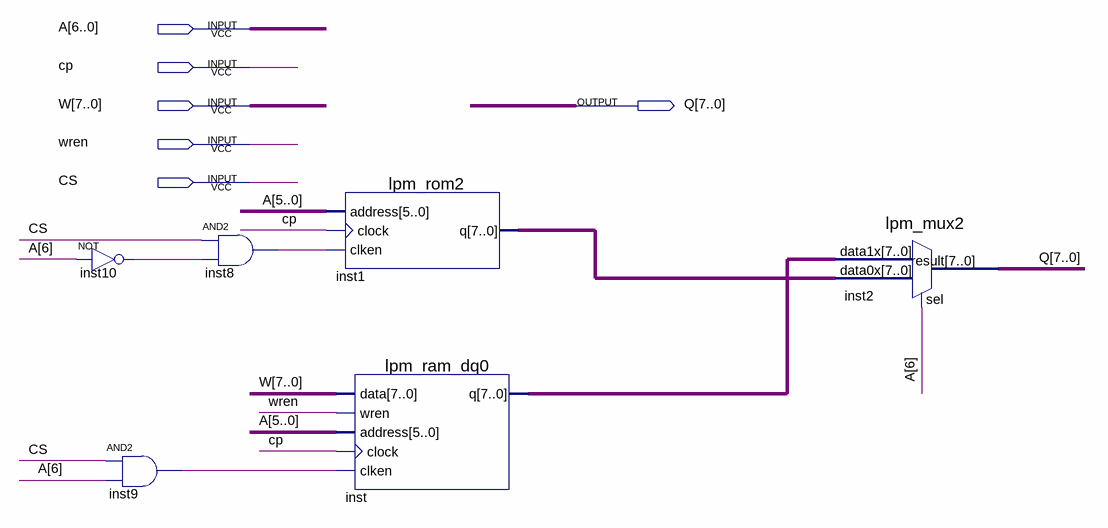
[diagram p0: schematic sheet]
// Quartus schematic MEM.bdf as structural Verilog: 6 symbols, 6 pins
module MEM (
  input  [6:0] A,
  input  cp,
  input  [7:0] W,
  input  wren,
  input  CS,
  output [7:0] Q
);

  wire inst8_out, inst9_out, inst10_out;
  wire [7:0] inst1_q, inst_q;

  not inst10 (inst10_out, A[6]);
  and inst9 (inst9_out, CS, A[6]);
  and inst8 (inst8_out, CS, inst10_out);
  lpm_rom2 inst1 (.address(A[5:0]), .clock(cp), .clken(inst8_out), .q(inst1_q));
  lpm_ram_dq0 inst (.data(W), .wren(wren), .address(A[5:0]), .clock(cp), .clken(inst9_out), .q(inst_q));
  lpm_mux2 inst2 (.data1x(inst_q), .data0x(inst1_q), .sel(A[6]), .result(Q));
endmodule
